# Altium schematic sheet BSPD.SchDoc
size A3; SheetNumber: 5; SheetTotal: 7
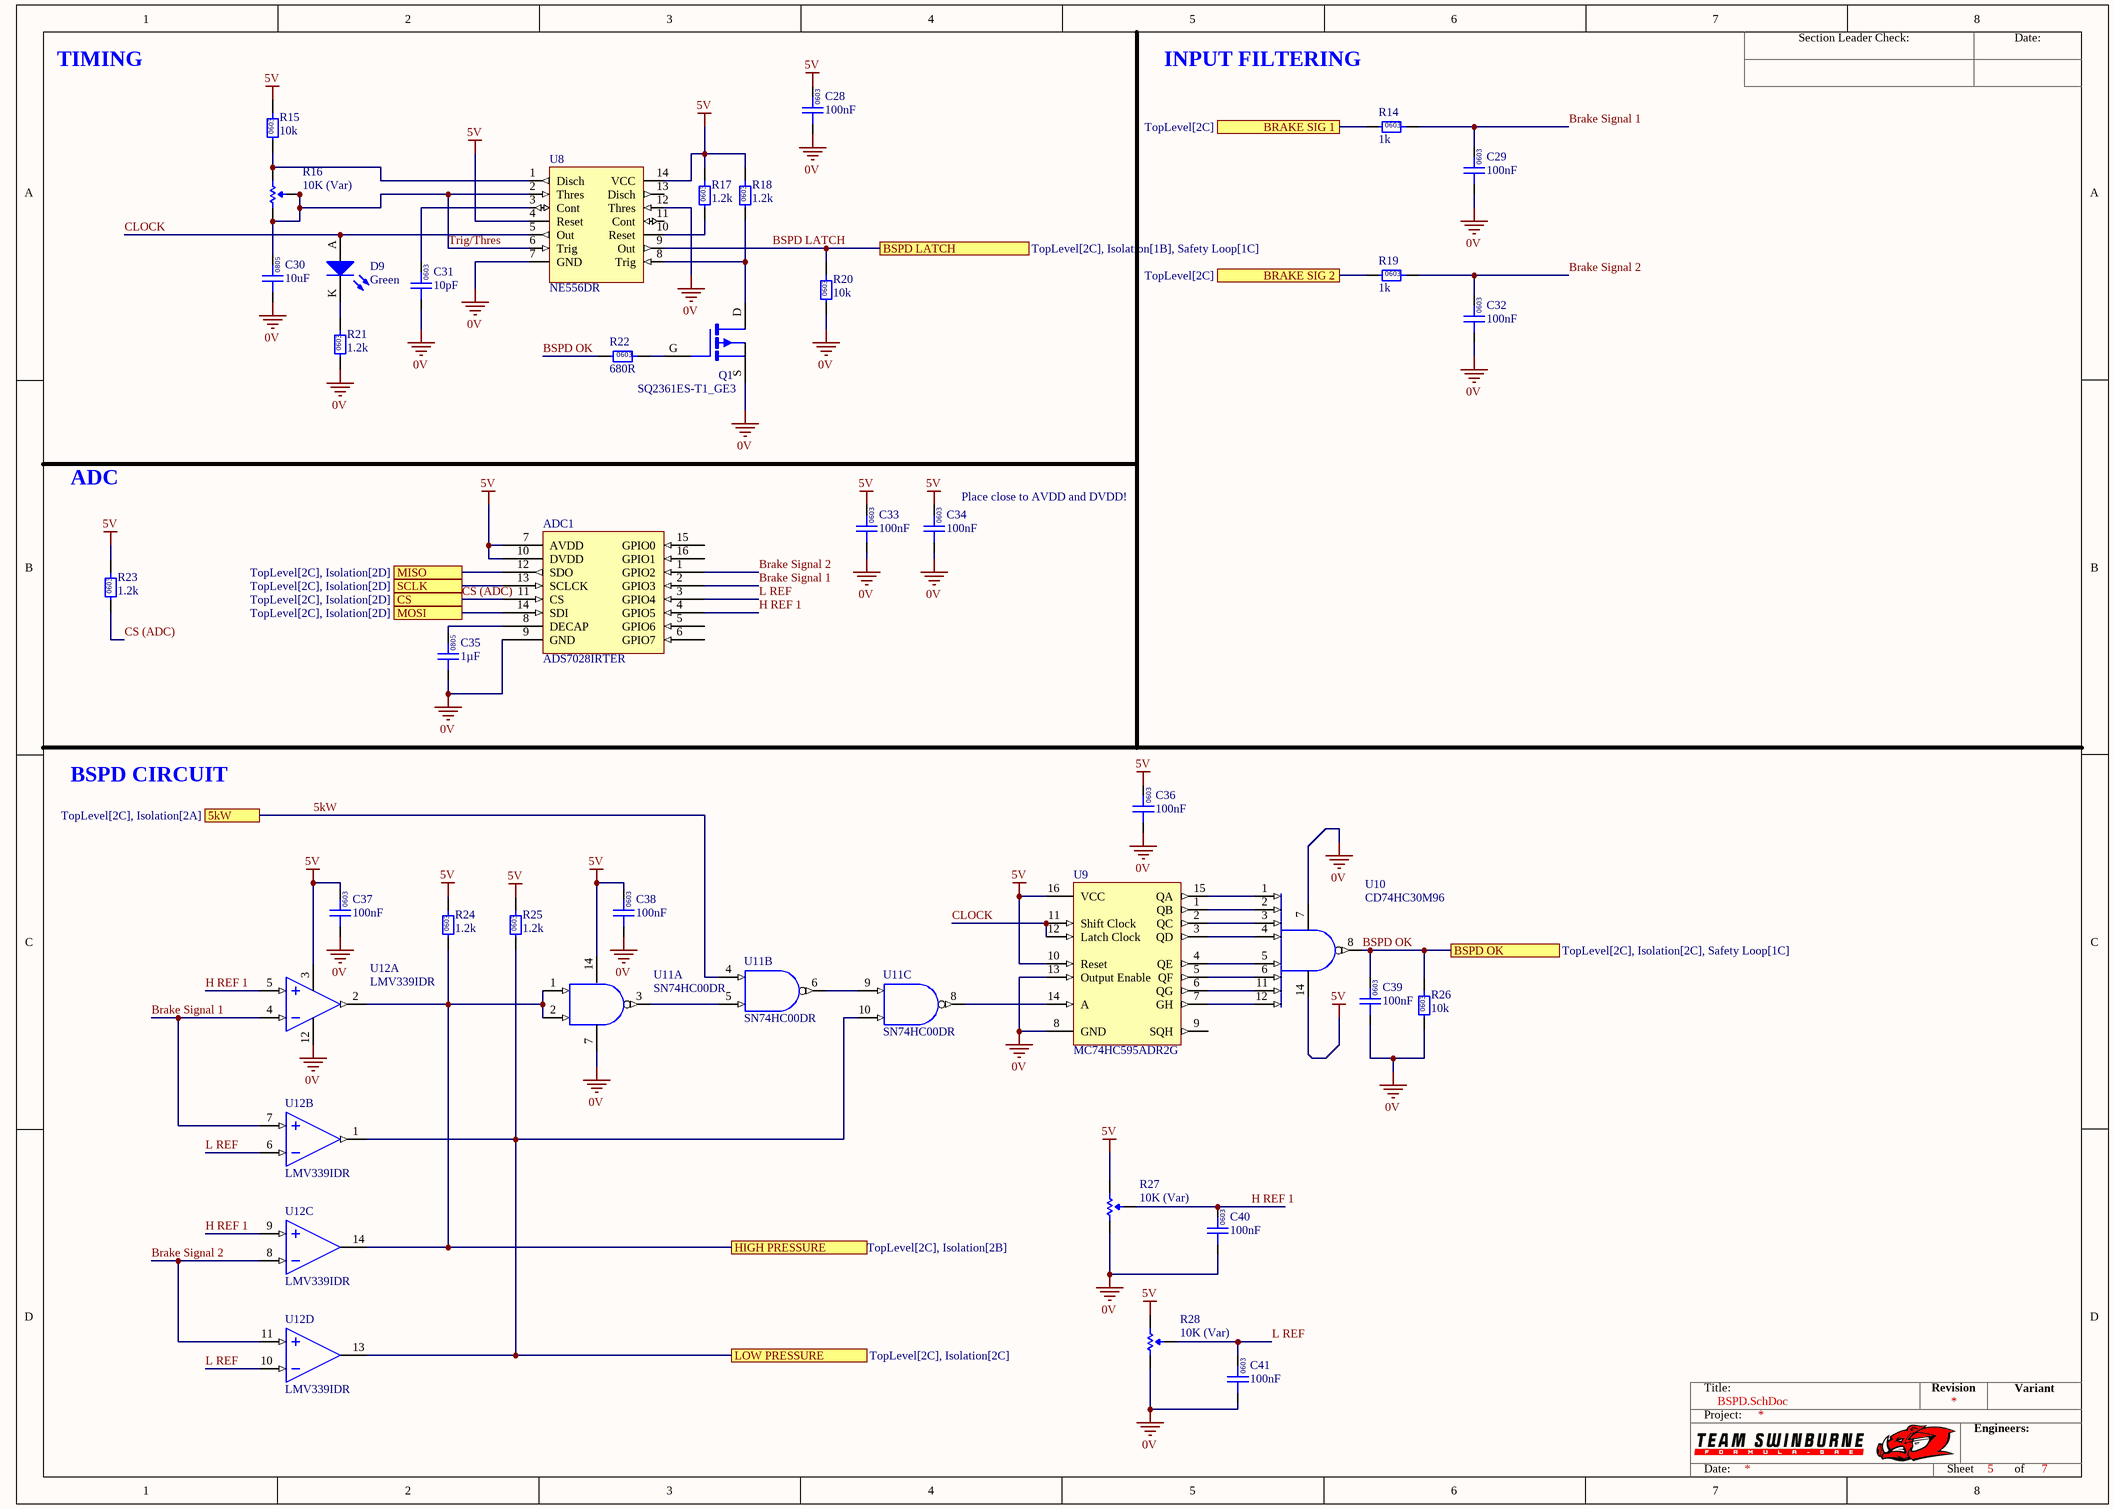
[diagram p0: BSPD.SchDoc]

## Parts
ADC1  ADS7028IRTER  [WFQN-16]
C28  100nF  [0603]
C29  100nF  [0603]
C30  10uF  [0805]
C31  10pF  [0603]
C32  100nF  [0603]
C33  100nF  [0603]
C34  100nF  [0603]
C35  1µF  [0805]
C36  100nF  [0603]
C37  100nF  [0603]
C38  100nF  [0603]
C39  100nF  [0603]
C40  100nF  [0603]
C41  100nF  [0603]
D9  Green  [0805 LED]
Q1  SQ2361ES-T1_GE3  [VSHY SOT-23-3]
R14  1k  [0603]
R15  10k  [0603]
R16  10K (Var)  [B 3296]
R17  1.2k  [0603]
R18  1.2k  [0603]
R19  1k  [0603]
R20  10k  [0603]
R21  1.2k  [0603]
R22  680R  [0603]
R23  1.2k  [0603]
R24  1.2k  [0603]
R25  1.2k  [0603]
R26  10k  [0603]
R27  10K (Var)  [3339P-1-1103LF]
R28  10K (Var)  [3339P-1-1103LF]
U8  NE556DR  [TI-SOIC14]
U9  MC74HC595ADR2G  [ON 16-SOIC]
U10  CD74HC30M96  [TI 14-SOIC]
U11  SN74HC00DR  [TI 14-SOIC]  (parts A,B,C of 4)
U12  LMV339IDR  [TI 14-SOIC]  (parts A,B,C,D of 4)

## Ports
5kW (see TopLevel[2C], Isolation[2A]), BRAKE SIG 1 (see TopLevel[2C]), BRAKE SIG 2 (see TopLevel[2C]), BSPD LATCH (see TopLevel[2C], Isolation[1B], Safety Loop[1C]), BSPD OK (see TopLevel[2C], Isolation[2C], Safety Loop[1C]), CS (see TopLevel[2C], Isolation[2D]), HIGH PRESSURE (see TopLevel[2C], Isolation[2B]), LOW PRESSURE (see TopLevel[2C], Isolation[2C]), MISO (see TopLevel[2C], Isolation[2D]), MOSI (see TopLevel[2C], Isolation[2D]), SCLK (see TopLevel[2C], Isolation[2D])

## Nets
0V: ADC1.9(GND) C28.1 C29.1 C30.1 C31.1 C32.1 C33.1 C34.1 C35.1 C36.1 C37.1 C38.1 C39.1 C40.1 C41.1 Q1.S R20.1 R21.1 R26.1 R27.3(CW) R28.3(CW) U8.7(GND) U8.12(Thres) U9.8(GND) U9.13(Output_Enable) U10.7(GND) U11.7(GND) U12.12(V-)
5V: ADC1.7(AVDD) ADC1.10(DVDD) C28.2 C33.2 C34.2 C36.2 C37.2 C38.2 R15.2 R17.2 R18.2 R23.2 R24.2 R25.2 R27.1(CCW) R28.1(CCW) U8.4(Reset) U8.14(VCC) U9.10(Reset) U9.16(VCC) U10.14(VCC) U11.14(VCC) U12.3(V+)
5kW: U11.4(2A) ; port 5kW
BRAKE SIG 1: R14.1 ; port BRAKE SIG 1
BRAKE SIG 2: R19.1 ; port BRAKE SIG 2
Brake Signal 1: ADC1.2(GPIO3) C29.2 R14.2 U12.4(IN_A-) U12.7(IN_B+)
Brake Signal 2: ADC1.1(GPIO2) C32.2 R19.2 U12.8(IN_C-) U12.11(IN_D+)
BSPD LATCH: R20.2 U8.9(Out) ; port BSPD LATCH
BSPD OK: C39.2 R22.1 R26.2 U10.8(Output) ; port BSPD OK
CLOCK: D9.A U8.5(Out) U9.11(Shift_Clock) U9.12(Latch_Clock)
CS (ADC): ADC1.11(CS) R23.1 ; port CS
H REF 1: ADC1.4(GPIO5) C40.2 R27.2(Wiper) U12.5(IN_A+) U12.9(IN_C+)
HIGH PRESSURE: R24.1 U11.1(1A) U11.2(1B) U12.2(OUT_A) U12.14(OUT_C) ; port HIGH PRESSURE
L REF: ADC1.3(GPIO4) C41.2 R28.2(Wiper) U12.6(IN_B-) U12.10(IN_D-)
LOW PRESSURE: R25.1 U11.10(3B) U12.1(OUT_B) U12.13(OUT_D) ; port LOW PRESSURE
MISO: ADC1.12(SDO) ; port MISO
MOSI: ADC1.14(SDI) ; port MOSI
SCLK: ADC1.13(SCLCK) ; port SCLK
Trig/Thres: C30.2 R16.2(Wiper) R16.3(CW) U8.2(Thres) U8.6(Trig)
NetADC1_8: ADC1.8(DECAP) C35.2
NetC31_2: C31.2 U8.3(Cont)
NetD9_K: D9.K R21.2
NetQ1_D: Q1.D R18.1 U8.8(Trig)
NetQ1_G: Q1.G R22.2
NetR15_1: R15.1 R16.1(CCW) U8.1(Disch)
NetR17_1: R17.1 U8.10(Reset)
NetU9_1: U9.1(QB) U10.2(Input)
NetU9_2: U9.2(QC) U10.3(Input)
NetU9_3: U9.3(QD) U10.4(Input)
NetU9_4: U9.4(QE) U10.5(Input)
NetU9_5: U9.5(QF) U10.6(Input)
NetU9_6: U9.6(QG) U10.11(Input)
NetU9_7: U9.7(GH) U10.12(Input)
NetU9_14: U9.14(A) U11.8(3Y)
NetU9_15: U9.15(QA) U10.1(Input)
NetU11_3: U11.3(1Y) U11.5(2B)
NetU11_6: U11.6(2Y) U11.9(3A)

Not connected (* = marked no-connect by the designer): ADC1 5(GPIO6) 6(GPIO7) 15(GPIO0) 16(GPIO1); U8 11(Cont) 13(Disch); U9 9(SQH)

## Notes on the sheet
- TIMING
- INPUT FILTERING
- ADC
- (near C34) Place close to AVDD and DVDD!
- BSPD CIRCUIT
- Section Leader Check:
- Date:
- Title:
- Revision
- Variant
- Project:
- Engineers:
- Sheet
- of
- (in symbol GCM21BR71H105KA03L) 0805
- (in symbol GCM188L81H104KA57D) 0603
- (in symbol GRM21BR6YA106KE43L) 0805
- (in symbol GRM1885C1H100JA01D) 0603
- (in symbol RC0603FR-071KL) 0603
- (in symbol RC0603FR-0710KL) 0603
- (in symbol RC0603JR-071K2L) 0603
- (in symbol RC0603JR-13680RL) 0603

## Library data of the parts
ADC1 = ADS7028IRTER: IC ADC 12BIT SAR 16WQFN; Manufacturer: Texas Instruments; Part Number: ADS7028IRTER; Digikey Part Number: ADS7028IRTER; Digikey Link: https://www.digikey.com.au/en/products/detail/texas-instruments/ADS7028IRTER/12696020?s=N4IgTCBcDaIIIBEDKB2ADGAHASQEoBUBRXEAXQF8g
C28 C29 C32-C34 C36-C41 = GCM188L81H104KA57D: Manufacturer: muRata; Rated Voltage: 50V; Tolerance: ±10%; Material: MLCC; Temperature Rating: X8L; Part Number: GCM188L81H104KA57D; Value: 100nF; Digikey Part Number: 490-6049-1-ND
C30 = GRM21BR6YA106KE43L: Manufacturer: muRata; Rated Voltage: 50V; Tolerance: 10%; Material: MLCC; Temperature Rating: X5R; Part Number: GRM21BR6YA106KE43L; Value: 10uF; Digikey Part Number: 490-10514-6-ND
C31 = GRM1885C1H100JA01D: Manufacturer: Murata Electronics; Rated Voltage: 50V; Tolerance: ±5%; Material: MLCC; Temperature Rating: C0G, NP0; Part Number: GRM1885C1H100JA01D; Value: 10pF; Digikey Part Number: 490-1403-1-ND
C35 = GCM21BR71H105KA03L: Manufacturer: muRata; Rated Voltage: 50V; Tolerance: ±10%; Material: MLCC; Temperature Rating: X7R; Part Number: GCM21BR71H105KA03L; Value: 1µF; Digikey Part Number: 490-10675-1-ND
D9 = SML-210FTT86: Green LED Indication - Discrete 1.75V 0805 (2012 Metric); Manufacturer: ROHM Semiconductor; Part Number: SML-210FTT86; Colour: Green; Digikey Part Number: 511-1285-1-ND
Q1 = SQ2361ES-T1_GE3: MOSFET P-CH 60V 2.8A SSOT23; Manufacturer: Vishay Siliconix; Type: P-channel; Rated Power: 2 W; Published: 24-Mar-1999; LatestRevisionDate: 29-May-2009; LatestRevisionNote: IPC-7351 Footprint Added.; PackageVersion: Sep-2000; PackageReference: SOT-343; Publisher: Altium Limited; PackageDescription: 4-Pin SOT-343 Package 1.3 mm Pitch, 2.1 mm Lead Span; Part Number: SQ2361ES-T1_GE3; Digikey Part Number: SQ2361ES-T1_GE3CT-ND
R14 R19 = RC0603FR-071KL: Manufacturer: YAGEO; Tolerance: 0.01; Rated Power: 0.1W; Part Number: RC0603FR-071KL; Value: 1k; Material: FR-07; Digikey Part Number: 311-1.00KHRCT-ND
R15 R20 R26 = RC0603FR-0710KL: Manufacturer: YAGEO; Tolerance: 0.01; Rated Power: 0.1W; Part Number: RC0603FR-0710KL; Value: 10k; Material: FR-07; Digikey Part Number: 311-10.0KHRCT-ND
R16 = 3296W-1-103LF: Manufacturer: Bournes Inc; Tolerance: 0.1; Rated Power: 0.5W; Part Number: 3296W-1-103LF; Value: 10K (Var); Digikey Part Number: 3296W-103LF-ND
R17 R18 R21 R23-R25 = RC0603JR-071K2L: Manufacturer: YAGEO; Tolerance: 0.01; Rated Power: 0.1W; Part Number: RC0603JR-071K2L; Value: 1.2k; Material: FR-07; Digikey Part Number: 311-1.2KGRCT-ND
R22 = RC0603JR-13680RL: Manufacturer: YAGEO; Tolerance: 0.01; Rated Power: 0.1W; Part Number: RC0603JR-13680RL; Value: 680R; Material: FR-07; Digikey Part Number: 13-RC0603JR-13680RLCT-ND
R27 R28 = 3339P-1-1103LF: Manufacturer: Bournes Inc; Tolerance: 0.1; Rated Power: 0.5W; Part Number: 3339P-1-1103LF; Value: 10K (Var)
U8 = NE556DR: IC OSC TIMER DUAL 100KHZ 14SOIC; Manufacturer: Texas Instruments; Part Number: NE556DR; Digikey Part Number: 296-26240-1-ND; Digikey Link: https://www.digikey.com.au/en/products/detail/texas-instruments/ne556dr/1571975
U9 = CMP-022-000000-1: IC SHIFT REGISTR 8BIT 3ST 16SOIC; Part Number: MC74HC595ADR2G
U10 = CMP-022-000012-1: IC GATE NAND 1CH 8-INP 14SOIC; Part Number: CD74HC30M96
U11 = CMP-022-000002-1: NAND Gate IC 4 Channel 14-SOIC; Part Number: SN74HC00DR
U12 = CMP-022-000001-1: Comparator General Purpose Open Collector 14-SOIC; Part Number: LMV339IDR